# EasyEDA Pro project Sisyphus.epro, board PCB1
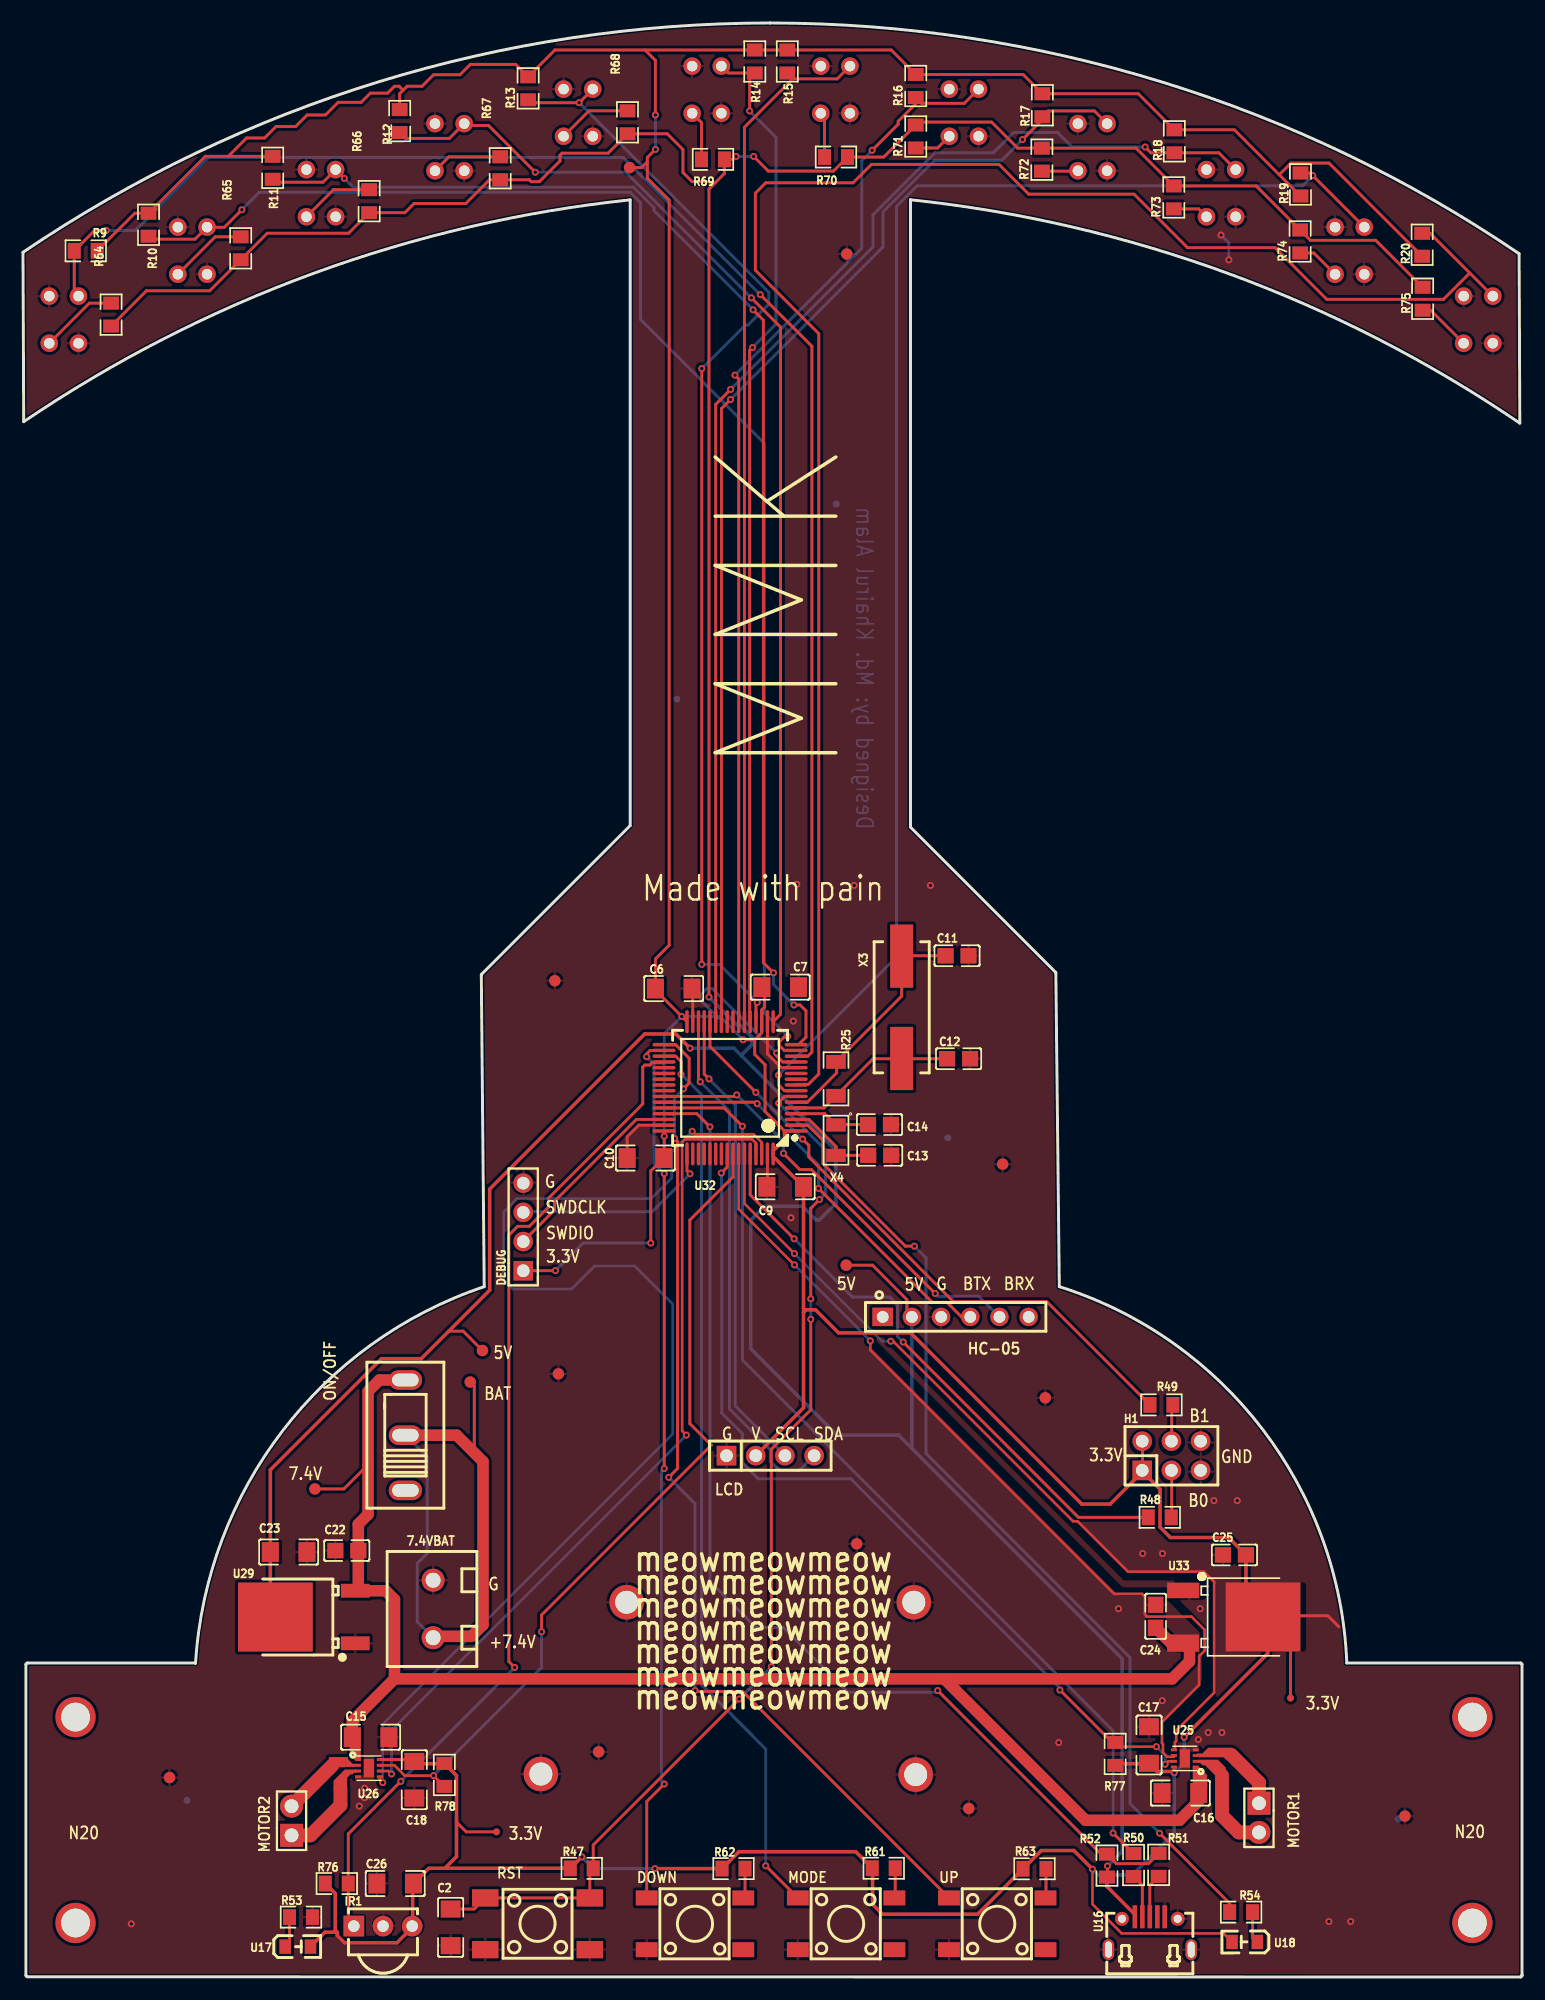
[diagram p3: board, top side]
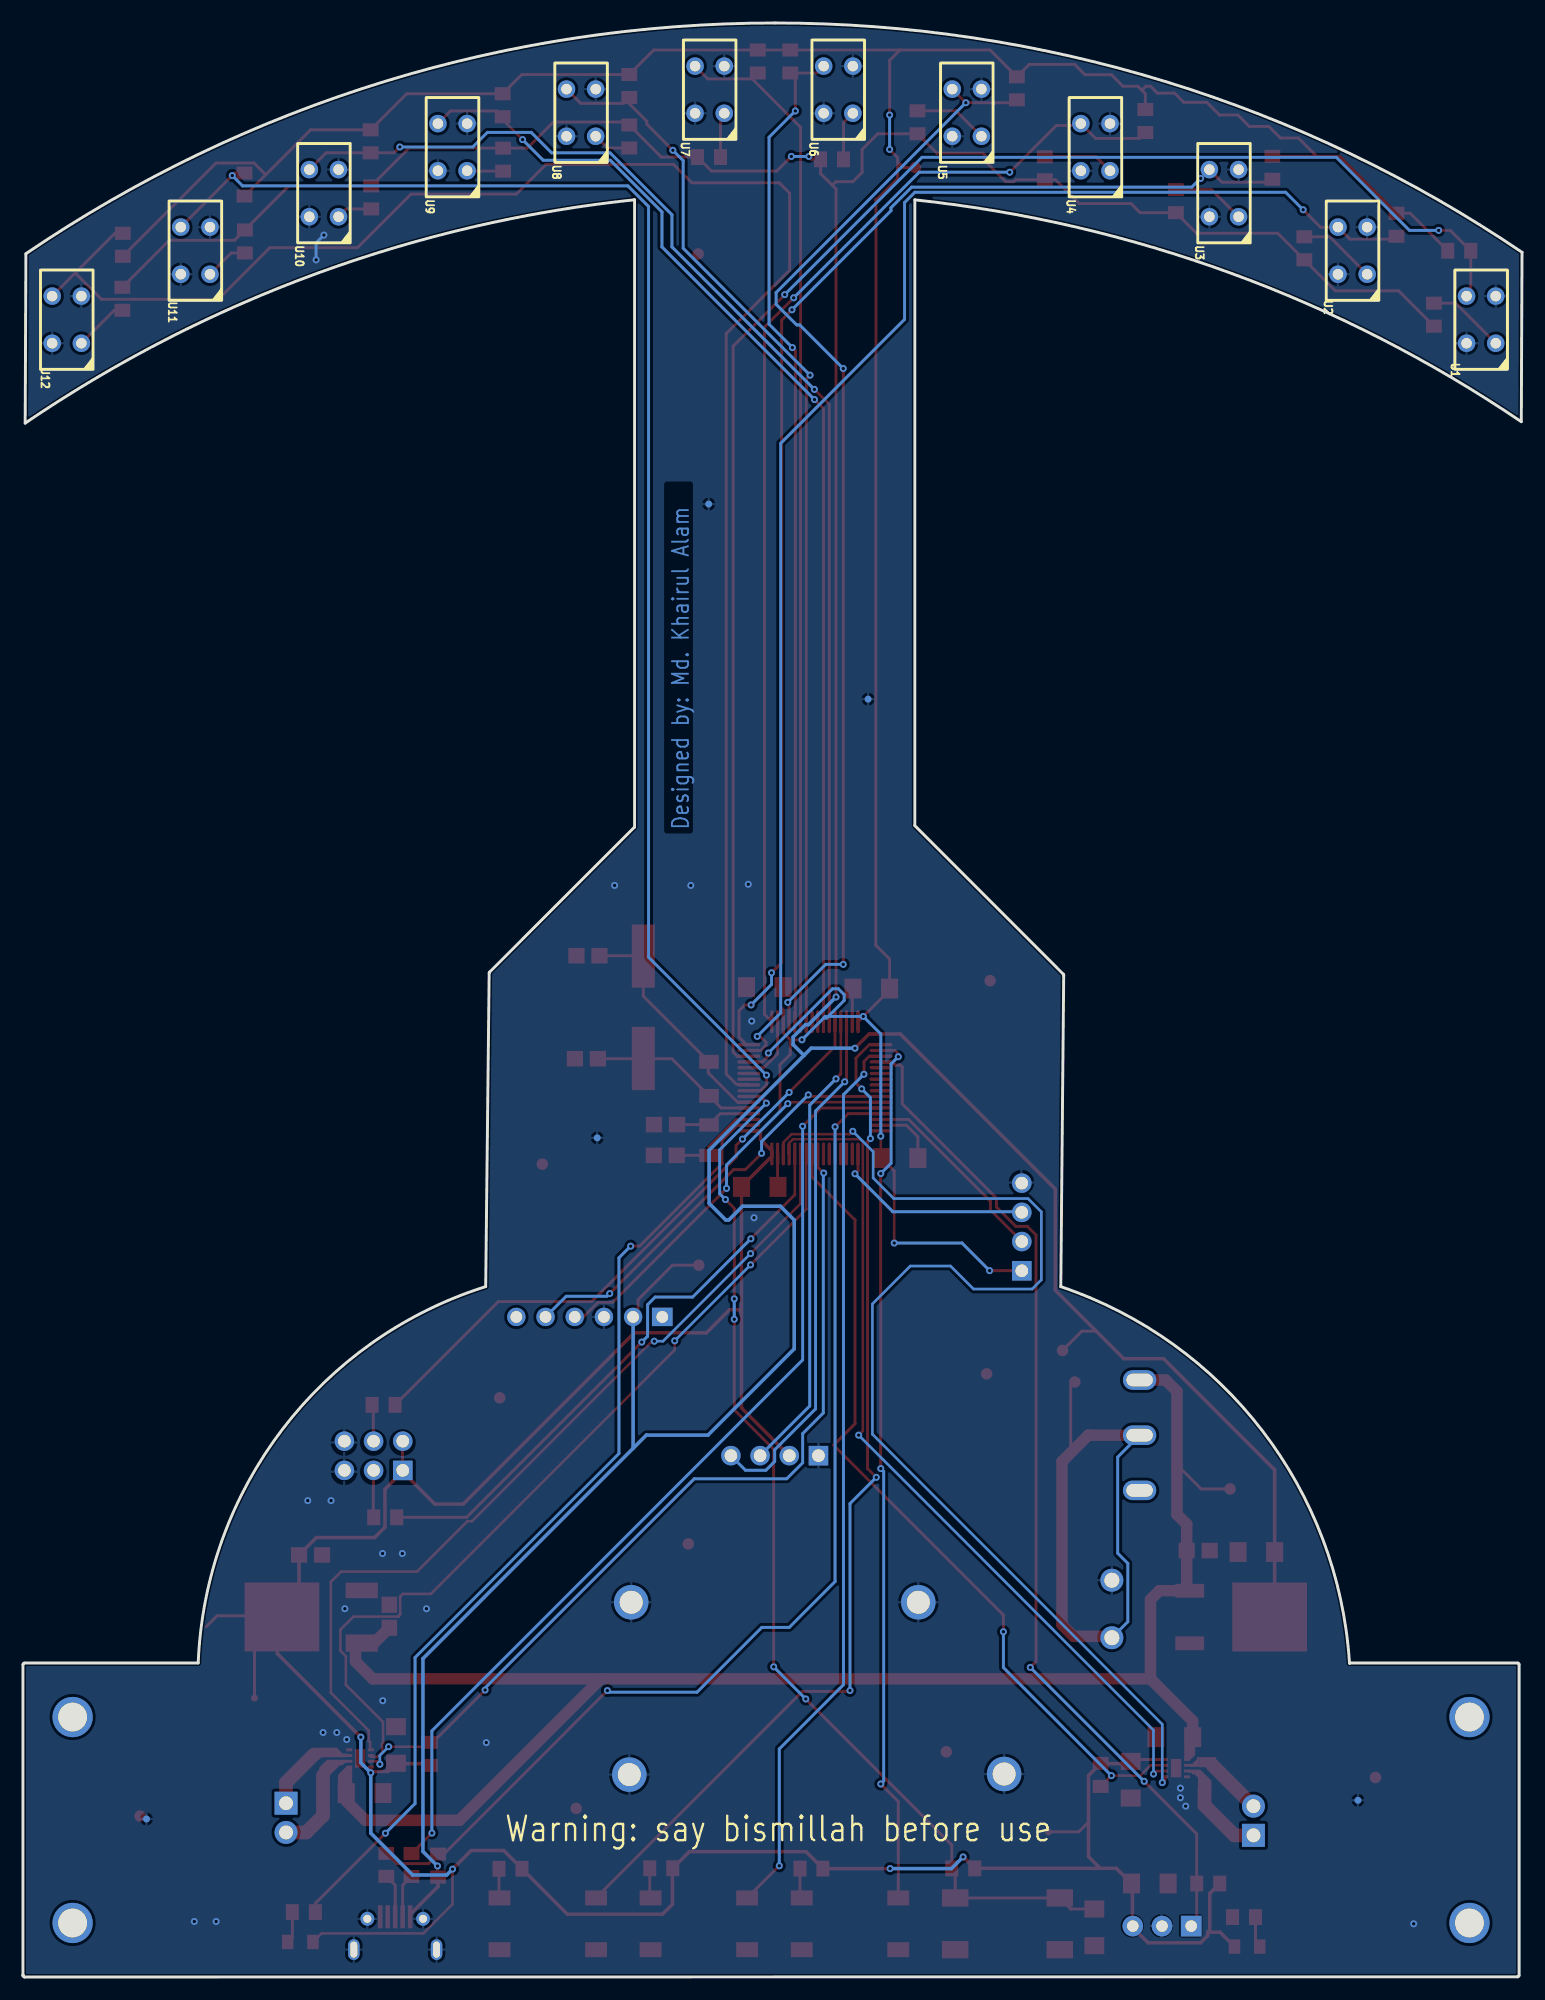
[diagram p4: board, bottom side, seen from below]

Outline 130.43 x 169.93 mm; copper layers: Top Layer, Bottom Layer. Coordinates in mm from the lower left corner of the outline.
Outline path: 0,149.99 arc(31,164.83) 64.99,169.93 arc(99.09,164.8) 130.18,149.86 130.24,135.13 arc(104.93,148.12) 77.22,154.55 77.22,100 89.83,87.39 arc(89.86,87.35) 89.87,87.3 90.17,60.04 arc(107.85,47.63) 115.18,27.31 130.3,27.31 arc(130.39,27.27) 130.43,27.18 130.43,0.18 arc(130.43,0.17) 130.43,0.15 arc(130.43,0.14) 130.43,0.13 arc(130.39,0.04) 130.3,0 0.38,0.02 arc(0.29,0.06) 0.25,0.15 0.25,27.18 arc(0.29,27.27) 0.38,27.31 14.99,27.31 arc(15,27.3) 15.01,27.3 15.01,27.3 arc(22.59,47.49) 40.13,60.03 39.88,87.12 arc(39.88,87.12) 39.88,87.12 arc(39.89,87.17) 39.92,87.21 52.83,100.13 52.83,154.55 arc(25.26,148.15) 0.06,135.25 0,149.99
Stack: Top Layer 0.035mm / Dielectric1 1.51mm FR4 er 4.5 / Bottom Layer 0.035mm

## Design rules (mm)
net $2N8179: DP1
net $2N8185: DP1
template: JLCPCB Capability(Two Layers Board)
spacing copperThickness1oz (default): track to track 0.102, other pairs 0.152 to 0.3
spacing copperThickness2oz: track to track 0.203, other pairs 0.152 to 0.3
track width copperThickness1oz (default): min 0.127, default 0.254, max 2.54
track width copperThickness2oz: min 0.203, default 0.254, max 2.54
differential pair differentialPair (default): width min 0.127, default 0.254, max 2.54; gap min 0.152, default 0.152
via viaSize (default): diameter min 0.5, default 0.61, max 10; hole min 0.3, default 0.305, max 6.3

## Placement (name value [footprint] x y rotation side)
7.4VBAT  7.4V BAT  [CONN-TH_WJ126V-5.0-2P]  35.69 32 180 top
C2  1uF  [C1206]  37.21 4.32 90 top
C6  100nF  [C1206]  56.62 85.96 180 top
C7  100nF  [C1206]  65.89 86.08 180 top
C9  100nF  [C1206]  66.32 68.72 0 top
C10  100nF  [C1206]  54.16 71.22 0 top
C11  22pF  [C0805]  81.27 88.81 0 top
C12  22pF  [C0805]  81.41 79.86 0 top
C13  22pF  [C0805]  74.54 71.46 0 top
C14  22pF  [C0805]  74.52 74.13 0 top
C15  100nF  [C1206]  30.25 20.86 180 top
C16  100nF  [C1206]  100.71 16 0 top
C17  100nF  [C1206]  97.98 20.18 270 top
C18  100nF  [C1206]  34.05 17.16 90 top
C22  10uF  [C0805]  28.17 37.08 0 top
C23  47uF  [C1206]  23.11 36.96 180 top
C24  10uF  [C0805]  98.55 31.37 270 top
C25  10uF  [C0805]  105.41 36.7 0 top
C26  100nF  [C1206]  32.39 8.13 0 top
DEBUG  61300411121  [HDR-TH_4P-P2.54-V-M-1]  43.52 65.23 90 top
DOWN  TS-1002S-05026C  [KEY-SMD_4P-L6.0-W6.0-P4.50-LS9.0]  58.47 4.63 0 top
H1  X5521WV-2X03-C46D46-1220  [HDR-TH_6P-P2.54-V-M-R2-C3-S2.54-3]  99.92 45.33 0 top
HC-05  HC-05  [HDR-TH_6P-P2.54-V-F]  81.15 57.4 0 top
IR1  IRM-3638T  [OPTO-TH_IRM-3638T]  31.32 4.43 0 top
LCD  LCD  [HDR-TH_4P-P2.54-V-F]  65.02 45.34 0 top
MODE  TS-1002S-05026C  [KEY-SMD_4P-L6.0-W6.0-P4.50-LS9.0]  71.62 4.63 0 top
MOTOR1  MOTOR1  [HDR-TH_2P-P2.54-V-M]  107.54 13.84 270 top
MOTOR2  MOTOR2  [HDR-TH_2P-P2.54-V-M]  23.37 13.59 90 top
NOREF  -  [Pad_e186912]  50.09 19.58 0 top
NOREF#2  -  [Pad_e145]  4.57 4.7 0 top
NOREF#3  -  [Pad_e185903]  39.98 54.48 0 top
NOREF#4  -  [Pad_e186911]  71.68 149.83 0 top
NOREF#5  -  [Pad_e152]  126.11 4.7 0 top
NOREF#6  -  [Pad_e185897]  41.2 12.62 0 top
NOREF#7  -  [Pad_e186914]  14.28 15.37 0 top
NOREF#8  -  [Pad_e186908]  72.54 37.67 0 top
NOREF#9  -  [Pad_e182908]  52.53 32.59 0 top
NOREF#10  -  [Pad_e186909]  85.24 70.69 0 top
NOREF#11  -  [Pad_e178781]  28.91 19.47 0 top
NOREF#12  -  [Pad_e185886]  25.4 42.44 0 top
NOREF#13  -  [Pad_e182909]  77.51 32.59 0 top
NOREF#14  -  [Pad_e186906]  46.58 52.45 0 top
NOREF#15  -  [Pad_e186917]  56.9 111.13 0 top
NOREF#16  -  [Pad_e186401]  52.78 157.35 0 top
NOREF#17  -  [Pad_e186916]  80.47 72.97 0 top
NOREF#18  -  [Pad_e178325]  28.09 17.23 0 top
NOREF#19  -  [Pad_e186907]  88.95 50.37 0 top
NOREF#20  -  [Pad_e182912]  77.67 17.6 0 top
NOREF#21  -  [Pad_e186910]  46.28 86.64 0 top
NOREF#22  -  [Pad_e185909]  71.63 61.9 0 top
NOREF#23  -  [Pad_e185885]  38.91 51.74 0 top
NOREF#24  -  [Pad_e143]  4.57 22.61 0 top
NOREF#25  -  [Pad_e185881]  110.29 24.26 0 top
NOREF#26  -  [Pad_e180150]  103.63 19.52 0 top
NOREF#27  -  [Pad_e180156]  102.41 17.34 0 top
NOREF#28  -  [Pad_e186905]  120.24 14 0 top
NOREF#29  -  [Pad_e186904]  12.75 17.35 0 top
NOREF#30  -  [Pad_e177865]  28.49 18.5 0 top
NOREF#31  -  [Pad_e186915]  119.69 13.74 0 top
NOREF#32  -  [Pad_e151]  126.11 22.61 0 top
NOREF#33  -  [Pad_e186913]  82.3 14.66 0 top
NOREF#34  -  [Pad_e186918]  70.76 128.09 0 top
NOREF#35  -  [Pad_e182911]  45.06 17.65 0 top
NOREF#36  -  [Pad_e180151]  103.44 18.36 0 top
NOREF#37  -  [Pad_e178324]  27.38 18.77 0 top
NOREF#38  -  [Pad_e180610]  102.75 18.55 0 top
ON/OFF  SS12D10G4 071  [SW-TH_SHOU-HAN_SS12D10G4]  33.27 47.12 90 top
R9  47kΩ  [R0805]  5.46 150.11 180 top
R10  47kΩ  [R0805]  10.92 152.38 90 top
R11  47kΩ  [R0805]  21.72 157.33 90 top
R12  47kΩ  [R0805]  32.77 161.4 270 top
R13  47kΩ  [R0805]  43.95 164.25 90 top
R14  47kΩ  [R0805]  63.67 166.58 90 top
R15  47kΩ  [R0805]  66.5 166.58 270 top
R16  47kΩ  [R0805]  77.68 164.45 90 top
R17  47kΩ  [R0805]  88.69 162.77 90 top
R18  47kΩ  [R0805]  100.18 159.64 270 top
R19  47kΩ  [R0805]  111.15 155.88 270 top
R20  47kΩ  [R0805]  121.74 150.64 270 top
R25  1MΩ  [R1206]  70.74 78.11 270 top
R47  10kΩ  [R0805]  48.62 9.45 180 top
R48  100kΩ  [R0805]  98.91 39.97 0 top
R49  100kΩ  [R0805]  99.06 49.75 180 top
R50  20Ω  [R0805]  96.63 9.74 270 top
R51  20Ω  [R0805]  98.81 9.75 270 top
R52  4.7kΩ  [R0805]  94.31 9.69 270 top
R53  470Ω  [R0805]  24.19 5.21 180 top
R54  470Ω  [R0805]  105.99 5.64 0 top
R61  10kΩ  [R0805]  74.89 9.46 180 top
R62  10kΩ  [R0805]  61.82 9.43 0 top
R63  10kΩ  [R0805]  88.01 9.41 180 top
R64  187Ω  [R0805]  7.67 144.56 270 top
R65  187Ω  [R0805]  18.94 150.33 270 top
R66  187Ω  [R0805]  30.12 154.43 270 top
R67  187Ω  [R0805]  41.52 157.29 270 top
R68  187Ω  [R0805]  52.6 161.29 270 top
R69  187Ω  [R0805]  60.04 158.07 0 top
R70  187Ω  [R0805]  70.74 158.27 0 top
R71  187Ω  [R0805]  77.68 160.06 90 top
R72  187Ω  [R0805]  88.65 158.04 90 top
R73  187Ω  [R0805]  100.13 154.76 90 top
R74  187Ω  [R0805]  111.12 150.93 90 top
R75  187Ω  [R0805]  121.78 145.94 90 top
R76  10kΩ  [R0805]  27.31 8.13 180 top
R77  10kΩ  [R0805]  95.03 19.4 270 top
R78  10kΩ  [R0805]  36.66 17.57 90 top
RST  -  [SW-SMD_4P-L6.0-W6.0-P4.50-LS9.0-2]  44.77 4.63 180 top
U1  LTH1550-01  [OPTO-TH_4P-L8.7-W4.5-P4.10_LTH1550-01]  3.56 144.13 90 bottom
U2  LTH1550-01  [OPTO-TH_4P-L8.7-W4.5-P4.10_LTH1550-01]  14.74 150.13 90 bottom
U3  LTH1550-01  [OPTO-TH_4P-L8.7-W4.5-P4.10_LTH1550-01]  25.93 155.13 90 bottom
U4  LTH1550-01  [OPTO-TH_4P-L8.7-W4.5-P4.10_LTH1550-01]  37.12 159.13 90 bottom
U5  LTH1550-01  [OPTO-TH_4P-L8.7-W4.5-P4.10_LTH1550-01]  48.31 162.13 90 bottom
U6  LTH1550-01  [OPTO-TH_4P-L8.7-W4.5-P4.10_LTH1550-01]  59.49 164.13 90 bottom
U7  LTH1550-01  [OPTO-TH_4P-L8.7-W4.5-P4.10_LTH1550-01]  70.68 164.13 90 bottom
U8  LTH1550-01  [OPTO-TH_4P-L8.7-W4.5-P4.10_LTH1550-01]  81.87 162.13 90 bottom
U9  LTH1550-01  [OPTO-TH_4P-L8.7-W4.5-P4.10_LTH1550-01]  93.06 159.13 90 bottom
U10  LTH1550-01  [OPTO-TH_4P-L8.7-W4.5-P4.10_LTH1550-01]  104.24 155.13 90 bottom
U11  LTH1550-01  [OPTO-TH_4P-L8.7-W4.5-P4.10_LTH1550-01]  115.43 150.13 90 bottom
U12  LTH1550-01  [OPTO-TH_4P-L8.7-W4.5-P4.10_LTH1550-01]  126.62 144.13 90 bottom
U16  HX MICRO XNJ JB  [MICRO-USB-SMD_MICRONJ5P-1.0-1.25]  98.04 3.81 0 top
U17  YLED0805R  [LED0805-RD]  23.92 2.64 0 top
U18  YLED0805R  [LED0805-RD]  106.3 3.05 180 top
U25  DRV8838DSGR  [WSON-8_L2.0-W2.0-P0.50-TL-EP]  101.09 19.01 180 top
U26  DRV8838DSGR  [WSON-8_L2.0-W2.0-P0.50-TL-EP]  30.1 18.16 0 top
U29  ZLDO1117QK50TC  [TO-252-3_L6.6-W6.1-P4.57-LS9.9-BR-CW]  25.44 31.3 0 top
U32  STM32F103RBT7  [LQFP-64_L10.0-W10.0-P0.50-LS12.0-BL]  61.52 77.33 90 top
U33  LD1117DT33CTR  [TO-252-2_L6.5-W6.1-P4.58-LS10.0-TL]  104.42 31.33 0 top
UP  TS-1002S-05026C  [KEY-SMD_4P-L6.0-W6.0-P4.50-LS9.0]  84.77 4.63 0 top
X3  8MHz  [CRYSTAL-SMD_L11.5-W4.8-LS12.7]  76.45 84.33 90 top
X4  32.768kHz  [OSC-SMD_2P-L3.2-W1.5]  70.74 72.77 270 top

## Footprints (pads in the part's own frame, mm; a bottom-side part is the same pattern mirrored in y, then rotated)
C0805
  rect 1.41x1.35 smd: 1(-1,0) 2(1,0)
C1206
  rect 1.485x1.728 smd: 1(-1.593,0) 2(1.593,0)
CONN-TH_WJ126V-5.0-2P
  round 2 hole 1.3: 1(0,2.501) 2(0,-2.501)
CRYSTAL-SMD_L11.5-W4.8-LS12.7
  rect 5.5x2 smd: 1(-4.45,0) 2(4.45,0)
HDR-TH_2P-P2.54-V-M
  rect 2x2 hole 1.2: 1(-1.27,0)
  round 2 hole 1.2: 2(1.27,0)
HDR-TH_4P-P2.54-V-F
  rect 1.7x1.7 hole 1.1: 1(-3.81,0)
  round 1.7 hole 1.1: 2(-1.27,0) 3(1.27,0) 4(3.81,0)
HDR-TH_4P-P2.54-V-M-1
  rect 1.7x1.7 hole 1.1: 1(-3.81,0)
  round 1.7 hole 1.1: 2(-1.27,0) 3(1.27,0) 4(3.81,0)
HDR-TH_6P-P2.54-V-F
  rect 1.8x1.6 hole 1.02: 1(-6.35,0)
  round 1.6 hole 1.02: 2(-3.81,0) 3(-1.27,0) 4(1.27,0) 5(3.81,0) 6(6.35,0)
HDR-TH_6P-P2.54-V-M-R2-C3-S2.54-3
  rect 1.7x1.7 hole 1.1: 1(-2.54,-1.27)
  round 1.7 hole 1.1: 2(-2.54,1.27) 3(0,-1.27) 4(0,1.27) 5(2.54,-1.27) 6(2.54,1.27)
KEY-SMD_4P-L6.0-W6.0-P4.50-LS9.0
  rect 1.9x1.3 smd: 1(-4.2,2.25) 2(4.2,2.25) 3(-4.2,-2.25) 4(4.2,-2.25)
LED0805-RD
  rect 1x1.25 smd: 1(-1.1,0) 2(1.1,0)
LQFP-64_L10.0-W10.0-P0.50-LS12.0-BL
  oval 0.3x2 smd: 1(-3.75,-5.75) 2(-3.25,-5.75) 3(-2.75,-5.75) 4(-2.25,-5.75) 5(-1.75,-5.75) 6(-1.25,-5.75) 7(-0.75,-5.75) 8(-0.25,-5.75) 9(0.25,-5.75) 10(0.75,-5.75) 11(1.25,-5.75) 12(1.75,-5.75) 13(2.25,-5.75) 14(2.75,-5.75) 15(3.25,-5.75) 16(3.75,-5.75) 33(3.75,5.75) 34(3.25,5.75) 35(2.75,5.75) 36(2.25,5.75) 37(1.75,5.75) 38(1.25,5.75) 39(0.75,5.75) 40(0.25,5.75) 41(-0.25,5.75) 42(-0.75,5.75) 43(-1.25,5.75) 44(-1.75,5.75) 45(-2.25,5.75) 46(-2.75,5.75) 47(-3.25,5.75) 48(-3.75,5.75)
  oval 2x0.3 smd: 17(5.75,-3.75) 18(5.75,-3.25) 19(5.75,-2.75) 20(5.75,-2.25) 21(5.75,-1.75) 22(5.75,-1.25) 23(5.75,-0.75) 24(5.75,-0.25) 25(5.75,0.25) 26(5.75,0.75) 27(5.75,1.25) 28(5.75,1.75) 29(5.75,2.25) 30(5.75,2.75) 31(5.75,3.25) 32(5.75,3.75) 49(-5.75,3.75) 50(-5.75,3.25) 51(-5.75,2.75) 52(-5.75,2.25) 53(-5.75,1.75) 54(-5.75,1.25) 55(-5.75,0.75) 56(-5.75,0.25) 57(-5.75,-0.25) 58(-5.75,-0.75) 59(-5.75,-1.25) 60(-5.75,-1.75) 61(-5.75,-2.25) 62(-5.75,-2.75) 63(-5.75,-3.25) 64(-5.75,-3.75)
MICRO-USB-SMD_MICRONJ5P-1.0-1.25
  rect 0.4x2 smd: 1(-1.3,1.427) 2(-0.65,1.427) 3(0,1.427) 4(0.65,1.427) 5(1.3,1.427)
  round 1.2 hole 0.7: 6(2.425,1.252) 9(-2.425,1.252)
  oval 1x1.8 hole 0.6x1.4: 7(3.6,-1.427) 8(-3.6,-1.427)
OPTO-TH_4P-L8.7-W4.5-P4.10_LTH1550-01
  round 1.524 hole 0.914: 1(-2.05,1.27) 2(2.05,1.27) 3(-2.05,-1.27) 4(2.05,-1.27)
OPTO-TH_IRM-3638T
  rect 1.8x1.8 hole 1: 1(-2.54,0)
  round 1.8 hole 1: 2(0,0) 3(2.54,0)
OSC-SMD_2P-L3.2-W1.5
  rect 1.15x1.7 smd: 1(-1.325,0) 2(1.325,0)
Pad_e143
  round 3.5 hole 2.5: 1(0,0)
Pad_e145
  round 3.5 hole 2.5: 1(0,0)
Pad_e151
  round 3.5 hole 2.5: 1(0,0)
Pad_e152
  round 3.5 hole 2.5: 2(0,0)
Pad_e177865
  custom 0.853x0.845 smd: 65(0,0)
Pad_e178324
  custom 1.524x0.888 smd: 66(0,0)
Pad_e178325
  custom 2.123x1.61 smd: 67(0,0)
Pad_e178781
  custom 0.952x1.118 smd: 68(0,0)
Pad_e180150
  custom 3.048x1.016 smd: 69(0,0)
Pad_e180151
  custom 2.409x1.495 smd: 70(0,0)
Pad_e180156
  custom 1.397x1.835 smd: 73(0,0)
Pad_e180610
  custom 0.752x0.267 smd: 71(0,0)
Pad_e182908
  round 3 hole 2: 1(0,0)
Pad_e182909
  round 3 hole 2: 2(0,0)
Pad_e182911
  round 3 hole 2: 1(0,0)
Pad_e182912
  round 3 hole 2: 2(0,0)
Pad_e185881
  round 0.61 smd: TP1(0,0)
Pad_e185885
  round 1 smd: TP2(0,0)
Pad_e185886
  round 1 smd: TP3(0,0)
Pad_e185897
  round 0.61 smd: TP4(0,0)
Pad_e185903
  round 1 smd: TP6(0,0)
Pad_e185909
  round 1 smd: TP8(0,0)
Pad_e186401
  round 1 smd: TP10(0,0)
Pad_e186904
  round 1 smd: TP12(0,0)
Pad_e186905
  round 1 smd: TP13(0,0)
Pad_e186906
  round 1 smd: TP14(0,0)
Pad_e186907
  round 1 smd: TP15(0,0)
Pad_e186908
  round 1 smd: TP16(0,0)
Pad_e186909
  round 1 smd: TP17(0,0)
Pad_e186910
  round 1 smd: TP18(0,0)
Pad_e186911
  round 1 smd: TP19(0,0)
Pad_e186912
  round 1 smd: TP20(0,0)
Pad_e186913
  round 1 smd: TP21(0,0)
Pad_e186914
  round 0.61 smd far side: TP22(0,0)
Pad_e186915
  round 0.61 smd far side: TP23(0,0)
Pad_e186916
  round 0.61 smd far side: TP24(0,0)
Pad_e186917
  round 0.61 smd far side: TP25(0,0)
Pad_e186918
  round 0.61 smd far side: TP26(0,0)
R0805
  rect 1.133x1.377 smd: 1(-1,0) 2(1,0)
R1206
  rect 1.208x1.701 smd: 1(-1.479,0) 2(1.479,0)
SW-SMD_4P-L6.0-W6.0-P4.50-LS9.0-2
  rect 2.3x1.5 smd: 1(-4.55,2.25) 2(4.55,2.25) 3(-4.55,-2.25) 4(4.55,-2.25)
SW-TH_SHOU-HAN_SS12D10G4
  oval 1.7x2.9 hole 1.1x2.3: 1(-4.8,0) 2(0,0) 3(4.8,0)
TO-252-2_L6.5-W6.1-P4.58-LS10.0-TL
  rect 2.8x1.35 smd: 1(-3.475,2.29)
  rect 2.8x1.5 smd: 3(-3.475,-2.29)
  rect 6.5x6 smd: 4(3.475,-0.017)
TO-252-3_L6.6-W6.1-P4.57-LS9.9-BR-CW
  rect 2.5x1.2 smd: 1(3.475,-2.286) 3(3.475,2.286)
  rect 6.5x6 smd: 2(-3.475,0)
WSON-8_L2.0-W2.0-P0.50-TL-EP
  rect 0.521x0.25 smd: 1(-0.95,0.75) 2(-0.95,0.25) 3(-0.95,-0.25) 4(-0.95,-0.75) 5(0.95,-0.75) 6(0.95,-0.25) 7(0.95,0.25) 8(0.95,0.75)
  rect 0.9x1.6 smd: 9(0,0)

## Nets
As in the schematic, except:
+3.3V: C6.2 C7.2 C9.2 C10.2 C17.2 C18.2 C25.2 C26.2 DEBUG.1 H1.1 H1.2 IR1.3 LCD.2 NOREF#6.TP4 NOREF#16.TP10 NOREF#25.TP1 R9.1 R10.2 R11.2 R12.1 R13.2 R14.2 R15.1 R16.2 R17.2 R18.1 R19.2 R20.2 R47.2 R61.2 R62.1 R63.2 R76.2 R77.2 R78.2 U17.2 U18.2 U25.8 U26.8 U32.1 U32.13 U32.19 U32.32 U32.48 U32.64 U33.4
+5V: C23.2 HC-05.2 NOREF#3.TP6 NOREF#22.TP8 R52.2 R64.2 R65.2 R66.2 R67.2 R68.2 R69.2 R70.2 R71.2 R72.2 R73.2 R74.2 R75.2 U16.1 U29.2
+7.4V: C15.2 C16.2 C22.2 C24.2 NOREF#11.68 NOREF#12.TP3 NOREF#27.73 ON/OFF.3 U25.1 U26.1 U29.3 U33.3
GND: 7.4VBAT.2 C2.1 C6.1 C7.1 C9.1 C10.1 C11.2 C12.2 C13.2 C14.2 C15.1 C16.1 C17.1 C18.1 C22.1 C23.1 C24.1 C25.1 C26.1 DEBUG.4 DOWN.3 H1.5 H1.6 HC-05.3 IR1.2 LCD.1 MODE.3 NOREF.TP20 NOREF#4.TP19 NOREF#7.TP22 NOREF#8.TP16 NOREF#9.1 NOREF#10.TP17 NOREF#13.2 NOREF#14.TP14 NOREF#15.TP25 NOREF#17.TP24 NOREF#19.TP15 NOREF#20.2 NOREF#21.TP18 NOREF#28.TP13 NOREF#29.TP12 NOREF#31.TP23 NOREF#33.TP21 NOREF#34.TP26 NOREF#35.1 R53.1 RST.1 RST.2 U1.1 U1.4 U2.1 U2.4 U3.1 U3.4 U4.1 U4.4 U5.1 U5.4 U6.1 U6.4 U7.1 U7.4 U8.1 U8.4 U9.1 U9.4 U10.1 U10.4 U11.1 U11.4 U12.1 U12.4 U16.5 U16.6 U16.7 U16.8 U16.9 U25.4 U25.9 U26.4 U26.9 U29.1 U32.12 U32.18 U32.31 U32.47 U32.63 U33.1 UP.3
$3N3618: MOTOR2.2 NOREF#30.65 NOREF#37.66 U26.2
$3N3619: MOTOR2.1 NOREF#18.67 U26.3
$3N3620: MOTOR1.2 NOREF#36.70 NOREF#38.71 U25.2
$3N3621: MOTOR1.1 NOREF#26.69 U25.3
$3N15654: 7.4VBAT.1 NOREF#23.TP2 ON/OFF.2

Pads without a net: DOWN 4; HC-05 1 6; MODE 4; NOREF#2 1; NOREF#5 2; NOREF#24 1; NOREF#32 1; ON/OFF 1; U16 4; U32 10 11 24 25 37 38 39 40 41 50 51 52 53 54 55; UP 4

## Via types
v1: diameter 0.61, hole 0.305, Top Layer to Bottom Layer, 116 vias

## Routing (per net, layer and track width the routed paths; a pad name or vN(x,y) marks a point on that pad's centre or on a via; arc(x,y) is an arc through that point)
+3.3V: length 565.8
  Top Layer w0.225: v1(93.06,9.38) 93.06,6.33 95.6,3.79 104.46,3.79 U18.2 ; 98.01,18.55 C17.2 ; 100.17,17.87 100.17,18.23 U25.8
  Top Layer w0.254: 54.32,157.85 54.32,156.43 56.22,154.53 56.22,89.73 55.03,88.53 C6.2 55.03,85.82 v1(57.32,83.53) U32.32 ; 54.32,157.85 53.83,157.35 NOREF#16.TP10 ; 54.32,157.85 54.32,158.23 v1(55.02,158.93) ; 63.67,81.5 64.27,82.11 U32.19 64.27,84.09 64.53,84.35 64.53,85.85 C7.2 ; 63.67,81.5 63.67,80.23 64.57,79.33 64.57,75.27 66.26,73.58 U32.1 ; 63.67,81.5 v1(62.65,81.5) ; 54.13,167.58 55.02,166.68 v1(55.02,161.93) ; 54.13,167.58 R14.2 R15.1 75.55,167.58 R16.2 87.02,165.45 R17.2 97.04,163.77 R18.1 105.4,160.64 109.31,156.73 ; 54.13,167.58 46.28,167.58 R13.2 42.87,166.33 38.92,166.33 38.02,165.43 35.72,165.43 34.72,164.43 33.42,164.43 33.06,164.06 ; 17.86,158.33 15.88,158.33 R10.2 9.73,153.38 R9.1 ; 17.86,158.33 R11.2 ; 17.86,158.33 19.46,159.93 21.02,159.93 22.02,160.93 23.72,160.93 24.72,161.93 26.32,161.93 27.42,163.03 29.42,163.03 30.22,163.83 31.72,163.83 32.32,164.43 32.72,164.43 33.06,164.09 33.06,164.06 ; v1(46.32,61.43) 43.6,61.43 43.56,61.47 ; 33.06,164.06 32.77,163.78 R12.1 ; NOREF#25.TP1 110.29,29.49 108.47,31.3 ; C18.2 33.89,18.91 U26.8 ; 37.72,13.47 38.57,12.62 NOREF#6.TP4 ; R20.2 113.64,157.75 110.32,157.75 109.31,156.73 ; v1(65.58,80.35) 65.58,80.1 66.1,79.58 U32.13 ; 97.41,46.48 97.41,43.94 ; 109.31,156.73 R19.2 ; 36.69,18.55 R78.2 ; 114.49,30.46 113.54,31.41 108.2,31.41 ; U32.48 55.79,73.56 v1(55.79,73.12) 55.79,71.26 C10.2 54.62,70.09 v1(54.62,63.83)
  Top Layer w0.305: v1(93.06,9.38) 91.44,11 88.6,11 R63.2 83.06,5.46 74.78,5.46 73.92,6.32 73.92,9.43 72.45,10.9 62.29,10.9 R62.1 v1(54.98,9.43) ; 27.35,3.89 27.35,3.59 27.97,2.98 32.54,2.98 33.9,4.34 33.9,8.05 34,8.15 35.31,9.46 36.7,9.46 ; 27.35,3.89 27.17,4.07 27.17,7.26 R76.2 ; 27.35,3.89 26.27,3.89 U17.2 ; 36.7,9.46 47.63,9.46 48.61,10.44 v1(48.63,10.44) ; 36.7,9.46 37.72,10.47 37.72,17.52 36.69,18.55 34.25,18.55 C18.2 ; R77.2 95.18,18.55 98.01,18.55 98.69,17.87 100.17,17.87 ; 66.26,73.58 66.26,72.84 65.27,71.85 U32.64 65.27,71.36 C9.2 67.91,57.8 ; LCD.2 67.91,49.5 67.91,57.8 ; 67.91,57.8 68.14,58.03 68.96,58.03 70.96,56.02 77.23,56.02 92.12,41.13 94.59,41.13 97.41,43.94 98.93,42.42 98.93,39.12 99.83,38.22 104.9,38.22 C25.2 106.41,33.36 108.28,31.49 ; 108.3,31.41 108.3,28.12 v1(101.03,20.86)
  Bottom Layer w0.254: v1(65.58,80.35) 59.99,85.94 59.48,85.94 58.98,85.43 58.98,84.92 60.37,83.53 ; v1(55.79,73.12) 55.79,82.01 v1(57.32,83.53) 60.37,83.53 ; v1(46.32,61.43) 48.72,63.83 v1(54.62,63.83) ; 60.37,83.53 60.5,83.4 60.75,83.4 ; 60.37,83.53 60.62,83.53 60.75,83.4 ; 60.75,83.4 v1(62.65,81.5) ; v1(55.02,158.93) v1(55.02,161.93)
  Bottom Layer w0.305: v1(93.06,9.38) 93.56,8.87 96.53,8.87 100.17,12.51 v1(100.17,17.76) 101.03,18.62 v1(101.03,20.86) ; v1(54.98,9.43) 49.65,9.43 v1(48.63,10.44)
+5V: length 415.2
  Top Layer w0.254: v1(62.05,158.32) 61.8,158.07 R69.2 61.02,158.06 61.02,156.83 60.01,155.81 ; v1(59.68,85.22) 59.68,155.49 60.01,155.81 ; NOREF#22.TP8 73.91,61.9 76.91,58.9 76.91,57.84 HC-05.2 ; 60.01,155.81 59.7,156.13 58.22,156.13 57.42,156.93 57.42,158.93 56.06,160.29 R68.2 50.91,158.61 46.9,158.61 46.72,158.43 46.72,157.93 44.92,156.13 44.22,156.13 44.06,156.29 R67.2 40.59,156.29 38.52,154.23 34.02,154.23 33.23,153.43 R66.2 28.33,151.64 21.25,151.64 R65.2 16.25,146.64 10.74,146.64 R64.2 ; v1(94.36,9.65) 94.36,8.73 R52.2 ; NOREF#3.TP6 38.3,56.16 37.05,56.16 ; v1(63.58,158.32) 64.85,157.05 70.52,157.05 R70.2 74.89,158.27 R71.2 77.93,161.31 84.28,161.31 86.55,159.04 R72.2 96.85,159.04 R73.2 107.29,155.76 R74.2 112.02,151.03 117.7,151.03 R75.2
  Top Layer w0.305: R52.2 94.31,7.87 96.74,5.44 U16.1 ; U29.2 21.52,31.74 C23.2 21.52,44.1 31.19,53.77 34.65,53.77 37.05,56.16 40.61,59.73 40.61,68.52 54.09,82.01 56.8,82.01 v1(58.04,80.77)
  Bottom Layer w0.254: v1(62.05,158.32) v1(63.58,158.32)
  Bottom Layer w0.305: 62.48,80.14 63.42,81.08 63.42,81.74 62.34,82.82 62.09,82.82 v1(59.68,85.22) ; 62.48,80.14 61.85,80.77 v1(58.04,80.77) ; 62.48,80.14 70.73,71.89 70.73,67.28 69.28,65.83 69.02,65.83 67.82,67.03 64.52,67.03 63.32,65.83 63.32,54.63 70.82,47.13 76.19,47.13 77.34,45.97 ; v1(94.36,9.65) 95.63,10.92 95.63,27.69 77.34,45.97 ; HC-05.2 77.34,45.97
+7.4V: length 147.7
  Top Layer w0.254: 30.02,44.55 27.92,42.44 NOREF#12.TP3
  Top Layer w1: 32.32,25.93 32.32,32.83 31.56,33.59 U29.3 29.17,33.85 C22.2 29.17,39.38 30.02,40.23 30.02,50.93 31.01,51.92 ON/OFF.3 ; 32.32,25.93 80.16,25.93 ; 32.32,25.93 28.66,22.26 C15.2 ; 80.16,25.93 92.46,13.63 100.62,13.63 102.3,15.3 C16.2 ; 80.16,25.93 99.99,25.93 101.5,27.44 101.5,29.01 99.91,29.01 C24.2
GND: length 19.5
  Top Layer w0.254: C10.1 52.57,73.07 53.57,74.08 U32.47 ; C6.1 58.27,85.89 U32.31 ; U32.12 65.97,79.08 64.77,80.28 U32.18 ; C9.1 64.77,68.76 U32.63
  Bottom Layer w0.254: v1(104.24,151.48) 104.92,150.8 v1(104.92,149.33)
  vias: v1(9.42,4.63) v1(29.26,14.86) v1(29.72,16.42) v1(29.72,15.59) v1(66.82,66.03) v1(67.02,83.13) v1(67.32,95.03) v1(72.32,94.93) v1(78.95,94.93) v1(90.12,20.39) v1(95.32,32.03) v1(97.42,36.83) v1(99.14,36.83) v1(99.12,24.03) v1(102.26,20.65) v1(102.42,32.03) v1(103.12,21.26) v1(103.62,41.43) v1(104.32,21.26) v1(105.65,41.43) v1(113.62,4.83) v1(115.52,4.83)
A0: length 141.3
  Top Layer w0.254: v1(64.15,146.3) 68.64,141.81 68.64,80.43 68.29,80.08 U32.14 ; v1(7.25,151.89) 6.24,151.89 R9.2 4.46,146.54 U1.2
  Bottom Layer w0.254: v1(7.25,151.89) 9.8,151.89 16.14,158.24 52.21,158.24 v1(64.15,146.3)
A1: length 125.7
  Top Layer w0.254: v1(66.54,81.8) 66.29,81.8 65.78,81.29 65.78,81.04 66.24,80.58 U32.15 ; R10.1 11.18,151.13 14.96,151.13 16,152.16 ; v1(19.04,153.68) 17.52,152.16 16,152.16 ; 16,152.16 U2.2
  Bottom Layer w0.254: v1(66.54,81.8) 64.5,83.84 64.5,133.37 53.72,144.15 53.72,154.31 52.83,155.21 20.57,155.21 v1(19.04,153.68)
A2: length 114.2
  Top Layer w0.254: v1(27.96,156.42) U3.2 26.1,156.08 21.98,156.08 R11.1 ; v1(63.52,144.99) 64.42,144.09 64.42,88.21 v1(65.3,87.33) ; v1(67.08,84.53) 67.62,84.53 68.12,84.03 68.12,81.73 67.47,81.08 U32.16
  Bottom Layer w0.254: v1(63.52,144.99) 54.91,153.6 54.91,153.86 53.11,155.65 28.72,155.65 v1(27.96,156.42) ; v1(65.3,87.33) 65.3,86.31 v1(67.08,84.53)
A3: length 102
  Top Layer w0.254: 38.22,161.01 37.1,159.89 33.28,159.89 R12.2 ; 38.22,161.01 40.51,161.01 v1(44.57,156.95) ; 38.22,161.01 U4.2 ; v1(63.37,146.03) 65.91,143.49 65.91,83.71 U32.17
  Bottom Layer w0.254: v1(44.57,156.95) 52.45,156.95 v1(63.37,146.03)
A4: length 98.5
  Top Layer w0.254: U5.2 v1(48.39,162.99) 44.2,162.99 R13.1 ; v1(59.06,139.88) v1(59.06,88.06) ; v1(63.88,84.76) 63.77,84.65 U32.20
  Bottom Layer w0.254: v1(59.06,88.06) 60.58,88.06 v1(63.88,84.76) ; v1(48.39,162.99) 64.9,146.48 64.9,145.47 63.1,143.67 62.85,143.67 v1(59.06,139.88)
A5: length 87.6
  Top Layer w0.254: v1(63.48,141.7) 63.23,141.45 63.23,83.12 U32.21 ; 63.23,165.58 61.36,165.58 U6.2 ; 63.23,165.58 v1(63.23,162.28) ; 63.23,165.58 R14.1
  Bottom Layer w0.254: v1(63.23,162.28) 65.51,159.99 65.51,143.73 v1(63.48,141.7)
A6: length 89.9
  Top Layer w0.254: R15.2 67,165.08 ; 67,165.08 67.01,165.07 70.84,165.07 U7.2 ; 67,165.08 62.77,160.86 U32.22
A7: length 93
  Top Layer w0.254: U8.2 81.9,162.94 78.19,162.94 77.95,163.18 ; U32.23 62.27,138.97 v1(61.95,139.3) ; R16.1 77.95,163.18 ; 77.95,163.18 76.15,161.38 76.15,161.13 v1(73.88,158.86)
  Bottom Layer w0.254: v1(73.88,158.86) 72.99,157.96 72.99,150.34 v1(61.95,139.3)
A8: length 100
  Top Layer w0.254: 88.74,161.82 88.74,161.56 v1(86.96,159.79) ; 88.74,161.82 R17.1 ; 88.74,161.82 89.2,162.28 93.22,162.28 U9.2 ; v1(61.56,137.18) 60.77,136.39 U32.26
  Bottom Layer w0.254: v1(61.56,137.18) 74.83,150.45 74.83,153.5 79.32,157.99 85.16,157.99 v1(86.96,159.79)
A9: length 111.7
  Top Layer w0.254: v1(97.64,159.14) 98.15,158.64 R18.2 104.06,158.64 U10.2 ; v1(61.57,138.06) 60.27,136.77 U32.27
  Bottom Layer w0.254: v1(97.64,159.14) 91.29,159.14 90.02,160.41 86.21,160.41 84.43,158.64 79.35,158.64 73.96,153.25 73.96,150.45 v1(61.57,138.06)
A10: length 127.2
  Top Layer w0.254: R19.1 112,156.88 v1(112.22,156.66) U11.2 ; v1(65.74,78.43) 65.74,77.59 66.25,77.08 U32.8
  Bottom Layer w0.254: v1(65.74,78.43) 76,88.69 76,153.96 77.79,155.76 111.32,155.76 v1(112.22,156.66)
A11: length 158.7
  Top Layer w0.254: 125.88,148.18 U12.2 ; 125.88,148.18 122.43,151.64 R20.1 ; 125.88,148.18 123.6,145.9 113.44,145.9 108.95,150.39 101.33,150.39 96.67,155.04 87.51,155.04 84.92,157.63 73.82,157.63 72.22,156.03 64.62,156.03 63.72,155.13 63.72,148.43 69.23,142.93 69.24,142.93 69.24,78.53 68.34,77.63 67.33,77.63 U32.9
BOOT0: length 51.4
  Top Layer w0.254: U32.60 63.27,68.02 v1(67.1,64.2) ; R48.1 91.83,39.97 v1(76.59,55.21)
  Bottom Layer w0.254: v1(76.59,55.21) 76.08,55.72 76.08,58.47 75.42,59.13 72.17,59.13 v1(67.1,64.2)
BOOT1: length 53.9
  Top Layer w0.254: v1(63.77,76.93) 59.77,80.92 U32.28 ; R49.2 89.08,58.73 80.95,58.73 68.38,71.31 68.38,72.32 v1(67.83,72.87)
  Bottom Layer w0.254: v1(67.83,72.87) v1(63.77,76.93)
BTN1: length 89.1
  Top Layer w0.254: UP.1 62.61,24.84 58.55,24.84 v1(58.47,24.91) ; v1(56.19,43.45) 56.95,44.22 56.95,72.66 v1(56.69,72.92) ; v1(57.46,77.24) 57.96,77.74 57.96,79.9 56.79,81.08 U32.33
  Bottom Layer w0.254: v1(57.46,77.24) 56.69,76.47 v1(56.69,72.92) ; v1(58.47,24.91) 58.47,41.17 v1(56.19,43.45)
BTN2: length 76.5
  Top Layer w0.254: v1(54.27,80.03) 54.27,80.28 54.56,80.58 U32.34 ; DOWN.1 54.27,15.26 v1(55.79,16.78) ; v1(55.79,44.22) v1(55.79,69.87)
  Bottom Layer w0.254: v1(55.79,16.78) 55.54,17.04 55.54,43.96 v1(55.79,44.22) ; v1(55.79,69.87) 54.9,70.77 54.9,79.4 v1(54.27,80.03)
BTN3: length 78.6
  Top Layer w0.254: MODE.1 v1(64.63,9.67) ; U32.35 56.79,80.08 57.26,79.61 v1(57.26,78.51)
  Bottom Layer w0.254: v1(64.63,9.67) 64.63,19.83 59.04,25.42 59.04,76.73 v1(57.26,78.51)
BTRX: length 37.8
  Top Layer w0.254: v1(62.1,76.71) 61.97,76.58 U32.42 ; v1(66.17,71.63) 67.58,70.21 68.6,70.21 v1(79.38,59.44)
  Bottom Layer w0.254: v1(66.17,71.63) 66.17,72.64 v1(62.1,76.71) ; HC-05.5 83.17,59.2 79.61,59.2 v1(79.38,59.44)
BTTX: length 35.6
  Top Layer w0.254: v1(69.22,68.58) 79.12,58.67 80.39,58.67 81.66,57.4 HC-05.4 ; v1(63.88,75.95) 63.75,76.08 U32.43
  Bottom Layer w0.254: v1(63.88,75.95) 69.22,70.61 v1(69.22,68.58)
IRSIGNAL: length 88.6
  Top Layer w0.254: v1(32.88,17.02) 28.31,12.45 R76.1 28.31,4.97 28.83,4.45 ; v1(42.78,26.92) 42.28,27.43 42.28,64.52 43.04,65.28 44.05,65.28 45.72,66.95 45.72,67.73 53.92,75.93 53.92,79.13 54.1,79.31 54.55,79.31 54.75,79.51 55.7,79.51 U32.36
  Bottom Layer w0.254: v1(32.88,17.02) v1(42.78,26.92)
M1P: length 75.4
  Top Layer w0.225: v1(73.73,55.33) 73.73,54.53 94.93,33.32 97.38,33.32 97.61,33.08 97.61,31.55 97.73,31.44 97.73,31.34 101.67,31.34 102.81,30.2 102.81,28.38 102.34,27.9 102.34,25.41 99.1,22.18 99.1,20.35 99.19,20.26 99.19,19.52 99.56,19.15 100.13,19.15 100.14,19.16 U25.6 ; U32.58 62.27,66.78 v1(67.12,61.93)
  Bottom Layer w0.225: v1(73.73,55.33) v1(67.12,61.93)
M1S: length 74.9
  Top Layer w0.225: U32.59 62.77,67.26 v1(67.12,62.91) ; v1(75.5,55.29) 75.71,55.29 91.37,39.63 91.76,39.63 96.14,35.25 102.75,35.25 103.64,34.36 103.64,24.73 100.34,21.43 100.34,20.53 100.23,20.41 100.23,19.84 U25.5
  Bottom Layer w0.225: v1(75.5,55.29) 74.74,55.29 v1(67.12,62.91)
M1SLEEP: length 76.9
  Top Layer w0.225: v1(98.62,20.03) 95.41,20.03 R77.1 ; U25.7 99.63,18.76 v1(99.38,18.5)
  Top Layer w0.254: v1(60.76,69.92) 61.27,70.43 U32.56 ; 95.05,20.39 94.79,20.39 v1(90.22,24.96)
  Bottom Layer w0.225: v1(99.38,18.5) 99.38,19.27 v1(98.62,20.03)
  Bottom Layer w0.254: v1(60.76,69.92) 60.79,69.88 60.79,49.05 62.59,47.25 62.59,44.71 63.98,43.33 72.02,43.33 90.22,25.13 v1(90.22,24.96)
M2P: length 74.4
  Top Layer w0.225: v1(32.06,17.66) 31.81,17.91 U26.6 ; U32.61 63.77,72.52 63.45,72.85 57.61,72.85 57.35,72.59 57.35,47.49 v1(57.72,47.12)
  Bottom Layer w0.225: v1(32.06,17.66) 32.06,21.47 v1(57.72,47.12)
M2S: length 103.9
  Top Layer w0.225: v1(58.23,73.55) 58.48,73.29 63.56,73.29 64.27,72.58 U32.62 ; v1(31.3,16.9) 31.05,17.16 U26.5
  Bottom Layer w0.225: v1(31.3,16.9) 31.3,21.98 56.52,47.2 56.52,58.53 53.22,61.83 49.72,61.83 47.72,59.83 42.62,59.83 41.82,60.63 41.82,66.54 42.98,67.69 54.66,67.69 56.46,69.49 56.46,71.78 v1(58.23,73.55)
M2SLEEP: length 72.8
  Top Layer w0.225: U26.7 32.32,18.41 33.22,17.51 v1(35.72,17.51) R78.1
  Top Layer w0.254: v1(45.12,30.03) 45.12,31.48 59.89,46.25 58.02,48.12 58.02,65.83 61.77,69.58 U32.57
  Bottom Layer w0.254: v1(35.72,17.51) 45.12,26.91 v1(45.12,30.03)
OSC32IN: length 8
  Top Layer w0.254: 70.75,71.46 X4.2 ; 70.75,71.46 C13.1 ; 70.75,71.46 70.75,72.22 68.39,74.58 U32.3
OSC32OUT: length 6.7
  Top Layer w0.254: C14.1 70.77,74.13 70.74,74.1 69.76,75.08 U32.4
OSCIN: length 14.9
  Top Layer w0.254: 76.48,79.86 73.97,79.86 R25.2 69.69,75.58 U32.5 ; 76.48,79.86 76.45,79.88 ; 76.48,79.86 C12.1
OSCOUT: length 21
  Top Layer w0.254: 70.8,79.64 70.8,78.63 68.25,76.08 U32.6 ; 70.8,79.64 76.45,85.3 X3.2 76.49,88.81 C11.1 ; 70.8,79.64 R25.1
PA11: length 84.8
  Top Layer w0.254: R50.1 v1(94.85,12.52) ; v1(62.59,73.99) 61,75.58 U32.44
  Bottom Layer w0.254: v1(62.59,73.99) 62.59,53.67 94.85,21.41 v1(94.85,12.52)
PA12: length 93.7
  Top Layer w0.254: U32.45 58.63,75.08 v1(59.77,73.93) ; v1(79.58,24.91) 93.81,10.69 R52.1 95.15,9.86 97.92,9.86 R51.1
  Bottom Layer w0.254: v1(59.77,73.93) 59.77,34.39 63.75,30.4 66.14,30.4 71.78,24.77 79.44,24.77 v1(79.58,24.91)
PC13: length 85.1
  Top Layer w0.254: U32.2 68.29,74.08 69.59,72.77 69.59,70.74 76.78,63.56 v1(77.56,63.56) ; v1(98.89,12.5) 104.99,6.41 R54.1
  Bottom Layer w0.254: v1(98.89,12.5) 96.32,15.08 96.32,27.78 78.57,45.52 78.57,62.54 v1(77.56,63.56)
RESET: length 93.6
  Top Layer w0.254: v1(68.54,57.2) 68.54,49.32 65.11,45.89 v1(65.11,26.97) ; v1(65.75,75.99) 65.75,76.07 66.26,76.58 U32.7 ; v1(69.31,67.61) 68.54,66.85 v1(68.54,58.98) ; C2.2 39.25,5.91 RST.4 RST.3 49.32,9.15 R47.1 49.62,11.48 v1(62.32,24.18)
  Bottom Layer w0.254: v1(69.31,67.61) 69.81,68.12 69.81,71.93 v1(65.75,75.99) ; v1(68.54,57.2) v1(68.54,58.98) ; v1(62.32,24.18) v1(65.11,26.97)
SCL: length 40.6
  Top Layer w0.254: v1(59.69,78.11) 59.27,78.52 U32.29
  Bottom Layer w0.254: LCD.3 61.98,49.66 61.98,75.82 v1(59.69,78.11)
SDA: length 45.5
  Top Layer w0.254: v1(58.93,77.85) 58.77,78.01 U32.30
  Bottom Layer w0.254: LCD.4 67.56,44.07 65.79,44.07 65.02,44.83 65.02,45.85 61.47,49.4 61.47,75.31 v1(58.93,77.85)
SWDCLK: length 17.7
  Top Layer w0.254: v1(58.04,69.85) 57.77,70.12 U32.49
  Bottom Layer w0.254: 43.56,66.55 54.74,66.55 v1(58.04,69.85)
SWDIO: length 17
  Top Layer w0.254: U32.46 53.37,74.58 46.25,67.46 46.25,66.7 43.56,64.01
$1N11364: length 6.8
  Top Layer w0.254: R64.1 5.77,145.56 U1.3
$1N11369: length 6.8
  Top Layer w0.254: U2.3 16.73,151.33 R65.1
$1N11378: length 6.4
  Top Layer w0.254: U3.3 27.02,155.43 R66.1
$1N11383: length 6.2
  Top Layer w0.254: R67.1 37.06,158.29 U4.3
$1N11389: length 6.5
  Top Layer w0.254: U5.3 49.25,162.29 R68.1
$1N11395: length 4.3
  Top Layer w0.254: U6.3 59.04,161.27 R69.1
$1N11401: length 3.9
  Top Layer w0.254: U7.3 69.74,161.75 R70.1
$1N11407: length 3.3
  Top Layer w0.254: U8.3 79.58,159.06 R71.1
$1N11413: length 3.1
  Top Layer w0.254: U9.3 91.75,157.04 R72.1
$1N11419: length 3.1
  Top Layer w0.254: U10.3 102.29,153.76 R73.1
$1N11425: length 3.8
  Top Layer w0.254: R74.1 112.31,149.93 U11.3
$1N11431: length 4.8
  Top Layer w0.254: R75.1 122.48,144.94 U12.3
$2N6151: length 4
  Top Layer w0.254: 99.95,43.94 99.95,40.01 R48.2
$2N6190: length 3.3
  Top Layer w0.254: 99.95,46.48 99.95,49.65 R49.1
$2N8179: length 3.8
  Top Layer w0.254: U16.2 97.39,7.97 R50.2
$2N8185: length 3.8
  Top Layer w0.254: U16.3 98.04,7.98 R51.2
$2N8518: length 2.7
  Top Layer w0.254: U17.1 23.19,3.02 R53.2
$2N8616: length 2.8
  Top Layer w0.254: R54.2 106.99,3.46 U18.1
$2N15281: length 2.6
  Top Layer w0.254: R63.1 89.01,6.92 UP.2
$2N15283: length 2.6
  Top Layer w0.254: DOWN.2 62.82,7.03 R62.2
$2N15284: length 2.6
  Top Layer w0.254: R61.1 75.89,6.95 MODE.2
$3N3618: length 5
  Top Layer w1.2: MOTOR2.2 26.92,18.41
$3N3619: length 7.2
  Top Layer w0.225: MOTOR2.1 23.37,12.64
  Top Layer w1.2: MOTOR2.1 25.02,12.32 27.62,14.93 27.62,16.43
$3N3620: length 7.3
  Top Layer w1.2: 104.32,17.53 104.32,14.03 105.78,12.57 MOTOR1.2
$3N3621: length 5.2
  Top Layer w1.2: 105.12,19.33 107.54,16.91 MOTOR1.1
$3N15654: length 52
  Top Layer w0.254: NOREF#23.TP2 39.27,51.38 39.27,45.95
  Top Layer w1: ON/OFF.2 37.73,47.12 40.02,44.83 40.02,30.63 39.02,29.63 35.81,29.63 7.4VBAT.1
  Bottom Layer w0.254: 7.4VBAT.1 34.3,30.89 34.3,35.97 35.18,36.85 35.18,45.21 ON/OFF.2

## Copper pours and planes (outline as drawn; the poured copper is in the pictures)
GND on Top Layer: 28.89,17.54 30.56,17.54 30.56,16.92 28.89,16.92
GND on Top Layer: 29.67,20.24 30.56,20.24 30.56,18.67 29.67,18.67
GND on Top Layer: 100.64,20.24 102.28,20.24 102.28,19.61 100.64,19.61
GND on Top Layer: -24.98,188.83 135.62,188.83 135.62,-8.77 -24.98,-8.77
GND on Bottom Layer: -7.33,172.82 138.18,172.82 138.18,-5.68 -7.33,-5.68

Small or netless copper shapes (teardrops, artwork), in the pictures only: 2 on Top Layer

## Text on the board
Bottom Layer: Designed by: Md. Khairul Alam
Bottom Silkscreen Layer: Warning: say bismillah before use
Top Silkscreen Layer: N20 | 7.4V | BAT | G | +7.4V | 5V | 3.3V | SWDCLK | SWDIO | V | SCL | SDA | BTX | BRX | B0 | B1 | GND | meowmeowmeow | Made with pain | MMK
